# EAGLE schematic Plug and play baord (EAGLE 8.2.1)
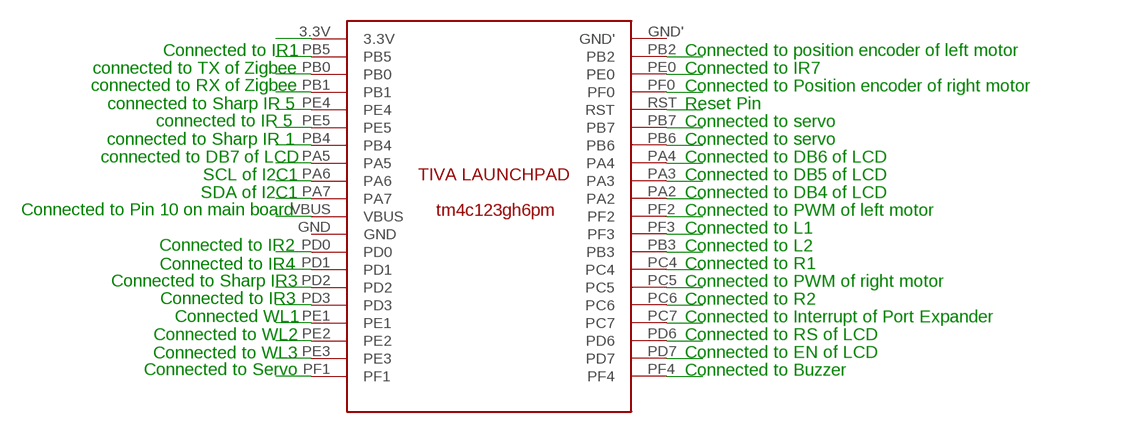
[diagram p0: schematic, sheet 1]

## Parts
U$2  TIVA_LAUNCHPADTIVA_LAUNCHPAD  [TIVA_LAUNCHPAD]

## Nets
3.3V [3.3V]: U$2.3.3V
5V2' [5V1]: U$2.VBUS
12: U$2.PB5
14: U$2.PB0
16: U$2.PD0
22: U$2.PD6
24: U$2.PD7
25: U$2.PA3
26: U$2.PA2
27: U$2.PA4
28: U$2.PA5
30: U$2.PE1
31: U$2.PE2
32: U$2.PE3
41: U$2.PD2
42: U$2.PD3
43: U$2.PD1
45: U$2.PE4
46: U$2.PE5
50: U$2.PF2
51: U$2.PF3
52: U$2.PB3
53: U$2.PC4
54: U$2.PC5
55: U$2.PC6
70: U$2.PE0
71: U$2.PF4
N$1: U$2.PB1
N$2: U$2.PB4
PB2: U$2.PB2
PB6: U$2.PB6
PB7: U$2.PB7
PC7: U$2.PC7
PF0: U$2.PF0
PF1: U$2.PF1
RST: U$2.RST
SCL: U$2.PA6
SDA: U$2.PA7
Unconnected: U$2.GND U$2.GND'

## Notes on the sheet
- Connected to IR1 | Connected to position encoder of left motor
- connected to TX of Zigbee | Connected to IR7
- connected to RX of Zigbee | Connected to Position encoder of right motor
- connected to Sharp IR 5 | Reset Pin
- connected to IR 5 | Connected to servo
- connected to Sharp IR 1 | Connected to servo
- connected to DB7 of LCD | Connected to DB6 of LCD
- SCL of I2C1 | Connected to DB5 of LCD
- SDA of I2C1 | Connected to DB4 of LCD
- Connected to Pin 10 on main board | Connected to PWM of left motor
- Connected to L1
- Connected to IR2 | Connected to L2
- Connected to IR4 | Connected to R1
- Connected to Sharp IR3 | Connected to PWM of right motor
- Connected to IR3 | Connected to R2
- Connected WL1 | Connected to Interrupt of Port Expander
- Connected to WL2 | Connected to RS of LCD
- Connected to WL3 | Connected to EN of LCD
- Connected to Servo | Connected to Buzzer

## Library data of the parts
U$2 = SMD_TIVA_LAUNCHPAD:TIVA_LAUNCHPAD

## Net classes
0 default: width 0.2 mm, clearance 0.2 mm
1 5V1: width 1 mm, clearance 0.2 mm
2 3.3V: width 1 mm, clearance 0.2 mm